# Altium schematic sheet Sch_MEZON.SchDoc
size A4
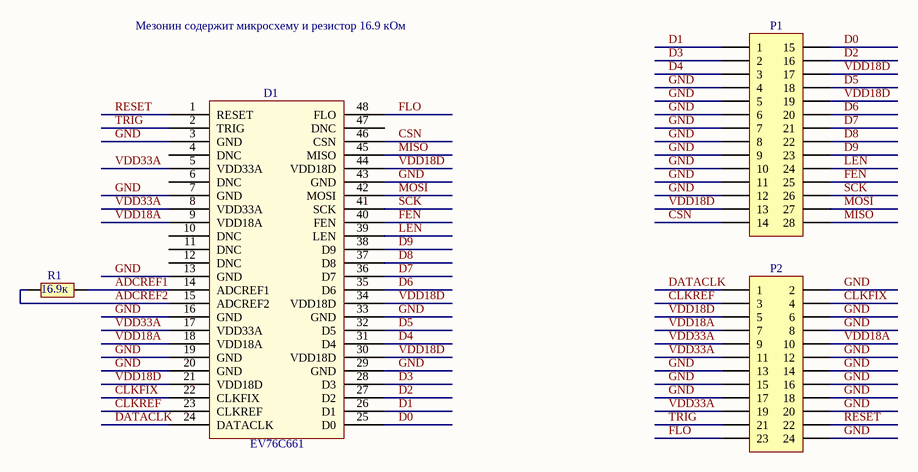
[diagram p0: Sch_MEZON.SchDoc]

## Parts
D1  EV76C661  [EV76C661]
P1  Header 14X2A  [HDR2X14_CEN]  (value not drawn)
P2  Header 12X2  [HDR2X12]  (value not drawn)
R1  16.9к  [RES]

## Nets
ADCREF1: D1.14(ADCREF1) R1.2
ADCREF2: D1.15(ADCREF2) R1.1
CLKFIX: D1.22(CLKFIX) P2.4
CLKREF: D1.23(CLKREF) P2.3
CSN: D1.46(CSN) P1.14
D0: D1.25(D0) P1.15
D1: D1.26(D1) P1.1
D2: D1.27(D2) P1.16
D3: D1.28(D3) P1.2
D4: D1.31(D4) P1.3
D5: D1.32(D5) P1.18
D6: D1.35(D6) P1.20
D7: D1.36(D7) P1.21
D8: D1.37(D8) P1.22
D9: D1.38(D9) P1.23
DATACLK: D1.24(DATACLK) P2.1
FEN: D1.40(FEN) P1.25
FLO: D1.48(FLO) P2.23
GND: D1.3(GND) D1.7(GND) D1.13(GND) D1.16(GND) D1.19(GND) D1.20(GND) D1.29(GND) D1.33(GND) D1.43(GND) P1.4 P1.5 P1.6 P1.7 P1.8 P1.9 P1.10 P1.11 P1.12 P2.2 P2.6 P2.8 P2.12 P2.13 P2.14 P2.15 P2.16 P2.17 P2.18 P2.20 P2.24
LEN: D1.39(LEN) P1.24
MISO: D1.45(MISO) P1.28
MOSI: D1.42(MOSI) P1.27
RESET: D1.1(RESET) P2.22
SCK: D1.41(SCK) P1.26
TRIG: D1.2(TRIG) P2.21
VDD18A: D1.9(VDD18A) D1.18(VDD18A) P2.7 P2.10
VDD18D: D1.21(VDD18D) D1.30(VDD18D) D1.34(VDD18D) D1.44(VDD18D) P1.13 P1.17 P1.19 P2.5
VDD33A: D1.5(VDD33A) D1.8(VDD33A) D1.17(VDD33A) P2.9 P2.11 P2.19

Not connected (* = marked no-connect by the designer): D1 4(DNC) 6(DNC) 10(DNC) 11(DNC) 12(DNC) 47(DNC)

## Notes on the sheet
- Мезонин содержит микросхему и резистор 16.9 кОм

## Library data of the parts
P1 = Header 14X2A: Header, 14-Pin, Dual row; LatestRevisionDate: 17-Jul-2002; LatestRevisionNote: Re-released for DXP Platform.; Publisher: Altium Limited
P2 = Header 12X2: Header, 12-Pin, Dual row; LatestRevisionDate: 17-Jul-2002; LatestRevisionNote: Re-released for DXP Platform.; Publisher: Altium Limited
R1 = RES